# Altium project Relay Board.PrjPCB
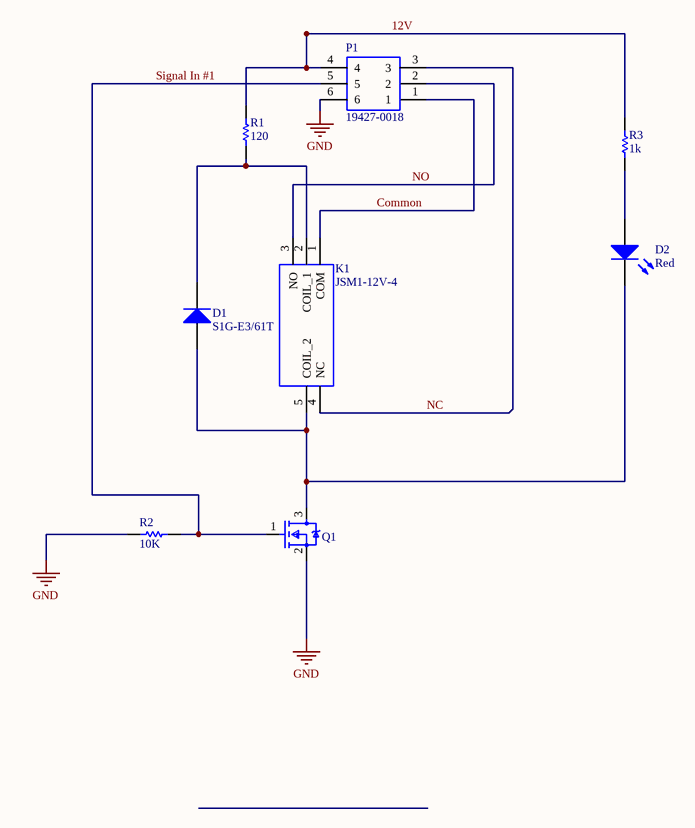
[diagram p0: Relay Board.SchDoc]
1 sheet, 8 parts. Net scope: global (net labels, ports and power ports of the same name join across sheets).
Board file: Relay Board.PcbDoc

## Sheet Relay Board.SchDoc
size A

### Parts
D1  S1G-E3/61T  [VISH-DO-214AC-SMA-2_N]
D2  Red  [LEDC3216X120NRED]
K1  JSM1-12V-4  [JSM112V4]
P1  19427-0018  [MX150L 6pin]
Q1  Trans_Diodes_2N7002-7-F_eec  [Diodes_2N7002-7-F_0]  (value not drawn)
R1  120  [RESC3216X60N]
R2  10K  [RESC3216X60N]
R3  1k  [RESC3216X60N]

### Nets
GND: P1.6 Q1.2(Source) R2.2
12V: P1.4 R1.2 R3.2
Common: K1.1(COM) P1.1
NC: K1.4(NC) P1.3
NO: K1.3(NO) P1.2
NetD1_1: D1.1(A) D2.2(K) K1.5(COIL_2) Q1.3(Drain)
NetD1_2: D1.2(K) K1.2(COIL_1) R1.1
NetD2_1: D2.1(A) R3.1
NetP1_5: P1.5 Q1.1(Gate) R2.1

### Notes on the sheet
- Labels drawn without touching a wire or pin: Signal In #1

### Library data of the parts
D1 = S1G-E3/61T: Surface Mount Glass Passivated Rectifier, 400 VDC, 1 A, -55 to 150 degC, 2-Pin SMD, RoHS, Tape and Reel; Manufacturer: Vishay Semiconductor; RoHSCompliant: true; REACH SVHC: Unknown; Min Operating Temperature: -55 degC; ComponentLink2Description: Datasheet; DatasheetVersion: 02/2016; Mount: Surface Mount; Package Quantity: 1800; ComponentLink1URL: http://www.vishay.com/; ComponentLink1Description: Manufacturer URL; Height: 2.29 mm; Packaging: Tape and Reel; Pins: 2; Length: 4.5 mm; Max Operating Temperature: 150 degC; Mounting Technology: Surface Mount; PackageReference: DO-214AC-2; PackageDescription: 2-Pin Surface Mount Device, Body 4.245 x 2.665 mm; ComponentLink2URL: http://www.vishay.com/docs/88711/s1.pdf; PartNumber: S1G-E3/61T; Supplier Part Number: S1G-E3/61TGICT-ND
D2 = LED2_2: Typical RED, GREEN, YELLOW, AMBER GaAs LED; Manufacturer: Broadcom Avago; Manufacturer Part Number: HSMY-C150; Lens Colour: White,Clear; Viewing Angle: 170°; Lens Style: Diffused,Colorless,Rectangular; Wavelength: 586nm; Luminous Intensity: 8mcd; Forward Current: 20mA; Forward Voltage: 2.1V; Number of LEDs: 1; Reverse Voltage: 5V; Power Dissipation: 65mW; Lens Transparency: Diffused; Published: 8-Jun-2000; LatestRevisionDate: 17-Jul-2002; LatestRevisionNote: Re-released for DXP Platform.; PackageVersion: Feb-2002; PackageReference: 3.2X1.6X1.1; Publisher: Altium Limited; PackageDescription: SM LED; 2 Flat Leads; Supplier 1: Digi-Key; Stock 1: 0; Mount: Surface Mount; Case/Package: 1206; Number of Pins: 2; Colour: Yellow; Case Code (Metric): 3216; Case Code (Imperial): 1206; Contact Plating: Gold; Min Operating Temperature: -40°C; Max Operating Temperature: 85°C; Packaging: Tape and Reel; Package Quantity: 1; Illumination Colour: Yellow; Dominant Wavelength: 586nm; Test Current: 20mA; Number of Elements: 1; Power Rating: 65mW; Max Power Dissipation: 65mW; Voltage Rating (DC): 2.1V; Length: 3.2mm; Height: 1.1mm; Width: 1.6mm; Depth: 1.6mm; Radiation Hardening: No; REACH SVHC: No SVHC; Lead Free: Lead Free; ComponentLink1URL: https://datasheet.ciiva.com/15117/getdatasheetpartid-110528-15117488.pdf; ComponentLink1Description: https://datasheet.ciiva.com/15117/getdatasheetpartid-110528-15117488.pdf; ComponentLink2URL: https://datasheet.ciiva.com/11774/0900766b804a6539-11774578.pdf; ComponentLink2Description: https://datasheet.ciiva.com/11774/0900766b804a6539-11774578.pdf; ComponentLink3URL: https://datasheet.ciiva.com/19466/1557071-19466435.pdf; ComponentLink3Description: https://datasheet.ciiva.com/19466/1557071-19466435.pdf; ComponentLink4URL: https://datasheet.ciiva.com/14172/swseriehsmx-c150toc190-e-14172159.pdf; ComponentLink4Description: https://datasheet.ciiva.com/14172/swseriehsmx-c150toc190-e-14172159.pdf; ComponentLink5URL: https://datasheet.ciiva.com/29280/180507-da-01-en-chip-led-hsmy-c150-gelb-29280997.pdf; ComponentLink5Description: https://datasheet.ciiva.com/29280/180507-da-01-en-chip-led-hsmy-c150-gelb-29280997.pdf; Stock 2: 0; ComponentLink6URL: https://datasheet.ciiva.com/11773/0900766b804a6539-11773956.pdf; ComponentLink6Description: https://datasheet.ciiva.com/11773/0900766b804a6539-11773956.pdf; ComponentLink7URL: https://datasheet.ciiva.com/15117/getdatasheetpartid-142358-15117749.pdf; ComponentLink7Description: https://datasheet.ciiva.com/15117/getdatasheetpartid-142358-15117749.pdf; ComponentLink8URL: https://datasheet.ciiva.com/46426/313031-46426533.pdf; ComponentLink8Description: https://datasheet.ciiva.com/46426/313031-46426533.pdf; ComponentLink9URL: https://datasheet.ciiva.com/14172/swseriehsmx-c150toc190-e-14172156.pdf; ComponentLink9Description: https://datasheet.ciiva.com/14172/swseriehsmx-c150toc190-e-14172156.pdf; ComponentLink10URL: https://datasheet.ciiva.com/29281/180509-da-01-en-chip-led-hsmh-c150-rot-29281009.pdf; ComponentLink10Description: https://datasheet.ciiva.com/29281/180509-da-01-en-chip-led-hsmh-c150-rot-29281009.pdf; Supplier Part Number: 732-4992-1-ND
K1 = JSM1-12V-4: PANASONIC ELECTRIC WORKS - JSM1-12V-4 - RELAY, AUTOMOTIVE, SPDT, 16VDC, 10A; Allied_Number: 70618207; Manufacturer_Name: Panasonic; Manufacturer_Part_Number: JSM1-12V-4; RS Part Number: *; RS Price/Stock: *; Allied Price/Stock: https://www.alliedelec.com/panasonic-jsm1-12v-4/70618207/; Arrow Part Number: JSM1-12V-4; Arrow Price/Stock: https://www.arrow.com/en/products/jsm1-12v-4/panasonic; Datasheet Link: https://media.digikey.com/pdf/Data%20Sheets/Panasonic%20Electric%20Works%20PDFs/JS-M_Series_Rev_Dec_2011.pdf; Supplier Part Number: 255-1239-ND
P1 = 19427-0018 MX150L 6pin: MX150L 6pin; Manufacturer_Name: Molex; Manufacturer_Part_Number: 19427-0018; Supplier Part Number: WM17506-ND
Q1 = Trans_Diodes_2N7002-7-F_eec: TRANS MOSFET N-CH 60V 115MA SOT23-3; Manufacturer: Diodes; Category 9E07530Daf1645C0: Semiconductors and Actives; Category E7B12Abbd6523C76: MOSFETs; Category 2F8Ae2801E7Ef44D: Uncategorized; min_breakdown_voltage_gate_to_source: -20 V; Category 3B27F62D0A3Ae0E0: Discretes (diodes, transistors, thyristors ...); power_dissipation: 300 mW; Category Aa6D67679B8D71Aa: N Channel MOSFET; polarity: N-Channel; breakdown_voltage_drain_to_source: 70 V; max_breakdown_voltage_gate_to_source: 20 V; rds_drain_to_source_resistance_on: 4.4 Ω; Category D77D1A77E69F0Cba: Transistors; Num Pins: 3; Part Number: 2N7002-7-F; helpURL: https://upverter.com/upn/revision/25d808f54d4a1cce/; ComponentLink2Description: Datasheet; Temperature: -55°C to +150°C; Package: SOT-23; Supplier 2: Mouser; Price: 0.0714567392161; Supplier 1: Digi-Key; ComponentLink1URL: https://upverter.com/upn/revision/25d808f54d4a1cce/; Supplier Part Number 2: 621-2N7002-F; Supplier Part Number: 2N7002-FDICT-ND; ComponentLink1Description: Upverter; ComponentLink2URL: https://upverter.com/datasheet/64901800f65d029d74a1b11cf5c344e3d7ff58ae.pdf; RoHS: TRUE; Mouser Part Number: 621-2N7002-F; voltage_rating_dc: 60 V; Ipc Land Pattern Name: SOT92P240X120-3; Category 6F04A20E5Eeab4C3: Uncategorized; Temperature Range High: +150°C; Digikey Description: TRANS MOSFET N-CH 60V 115MA SOT23-3; Digikey Part Number: 2N7002-FDICT-ND; Lead Free: yes; vds_drain_to_source_voltage: 60 V; Category 931F5E15A77D48D8: Uncategorized; Temperature Range Low: -55°C; id_continuous_drain_current: 115 mA; Mounting Type: surface mount; current_rating: 115 mA; Octopart Part Number: e39a2a95da213c5d
R1 = Res1: Resistor; Manufacturer: Stackpole Electronics; Manufacturer Part Number: RNCP1206FTD1K00; Value: 10K; Resistance: 120R; Tolerance: 1%; Temperature Coefficient: 100ppm/°C; Max Power Dissipation: 500mW; Supplier Part Number: A129547CT-ND; Supplier 1: Digi-Key; Stock 1: 679; Pricing 1: 1=0.1, 10=0.052, 100=0.0211, 1000=0.00949, 2500=0.00824 (USD); Mount: Surface Mount; Case/Package: 1206; Case Code (Metric): 3216; Case Code (Imperial): 1206; Contact Plating: Nickel,Tin,Matte; Min Operating Temperature: -55°C; Max Operating Temperature: 155°C; Packaging: Tape and Reel; Composition: Thin Film; Number of Terminations: 2; Length: 0.122inch; Height: 0.024inch; Width: 0.059inch; Radiation Hardening: No; Lead Free: Lead Free; ComponentLink1URL: http://www.seielect.com/Catalog/SEI-rncp.pdf; ComponentLink1Description: http://www.seielect.com/Catalog/SEI-rncp.pdf; ComponentLink2URL: https://www.seielect.com/catalog/SEI-Packaging.pdf; ComponentLink2Description: https://www.seielect.com/catalog/SEI-Packaging.pdf
R2 = Res1: Resistor; Manufacturer: Stackpole Electronics; Manufacturer Part Number: RNCP1206FTD1K00; Resistance: 120R; Tolerance: 1%; Temperature Coefficient: 100ppm/°C; Max Power Dissipation: 500mW; Value: 10K; Supplier Part Number: RNCP1206FTD10K0CT-ND; Supplier 1: Digi-Key; Stock 1: 679; Pricing 1: 1=0.1, 10=0.052, 100=0.0211, 1000=0.00949, 2500=0.00824 (USD); Mount: Surface Mount; Case/Package: 1206; Case Code (Metric): 3216; Case Code (Imperial): 1206; Contact Plating: Nickel,Tin,Matte; Min Operating Temperature: -55°C; Max Operating Temperature: 155°C; Packaging: Tape and Reel; Composition: Thin Film; Number of Terminations: 2; Length: 0.122inch; Height: 0.024inch; Width: 0.059inch; Radiation Hardening: No; Lead Free: Lead Free; ComponentLink1URL: http://www.seielect.com/Catalog/SEI-rncp.pdf; ComponentLink1Description: http://www.seielect.com/Catalog/SEI-rncp.pdf; ComponentLink2URL: https://www.seielect.com/catalog/SEI-Packaging.pdf; ComponentLink2Description: https://www.seielect.com/catalog/SEI-Packaging.pdf
R3 = Res1: Resistor; Manufacturer: Stackpole Electronics; Manufacturer Part Number: RNCP1206FTD1K00; Value: 10K; Resistance: 10kR; Tolerance: 1%; Temperature Coefficient: 100ppm/°C; Max Power Dissipation: 500mW; Supplier Part Number: RNCP1206FTD1K00CT-ND; Supplier 1: Digi-Key; Stock 1: 679; Pricing 1: 1=0.1, 10=0.052, 100=0.0211, 1000=0.00949, 2500=0.00824 (USD); Mount: Surface Mount; Case/Package: 1206; Case Code (Metric): 3216; Case Code (Imperial): 1206; Contact Plating: Nickel,Tin,Matte; Min Operating Temperature: -55°C; Max Operating Temperature: 155°C; Packaging: Tape and Reel; Composition: Thin Film; Number of Terminations: 2; Length: 0.122inch; Height: 0.024inch; Width: 0.059inch; Radiation Hardening: No; Lead Free: Lead Free; ComponentLink1URL: http://www.seielect.com/Catalog/SEI-rncp.pdf; ComponentLink1Description: http://www.seielect.com/Catalog/SEI-rncp.pdf; ComponentLink2URL: https://www.seielect.com/catalog/SEI-Packaging.pdf; ComponentLink2Description: https://www.seielect.com/catalog/SEI-Packaging.pdf